# Altium schematic sheet 990130_Schematic.SchDoc
size A
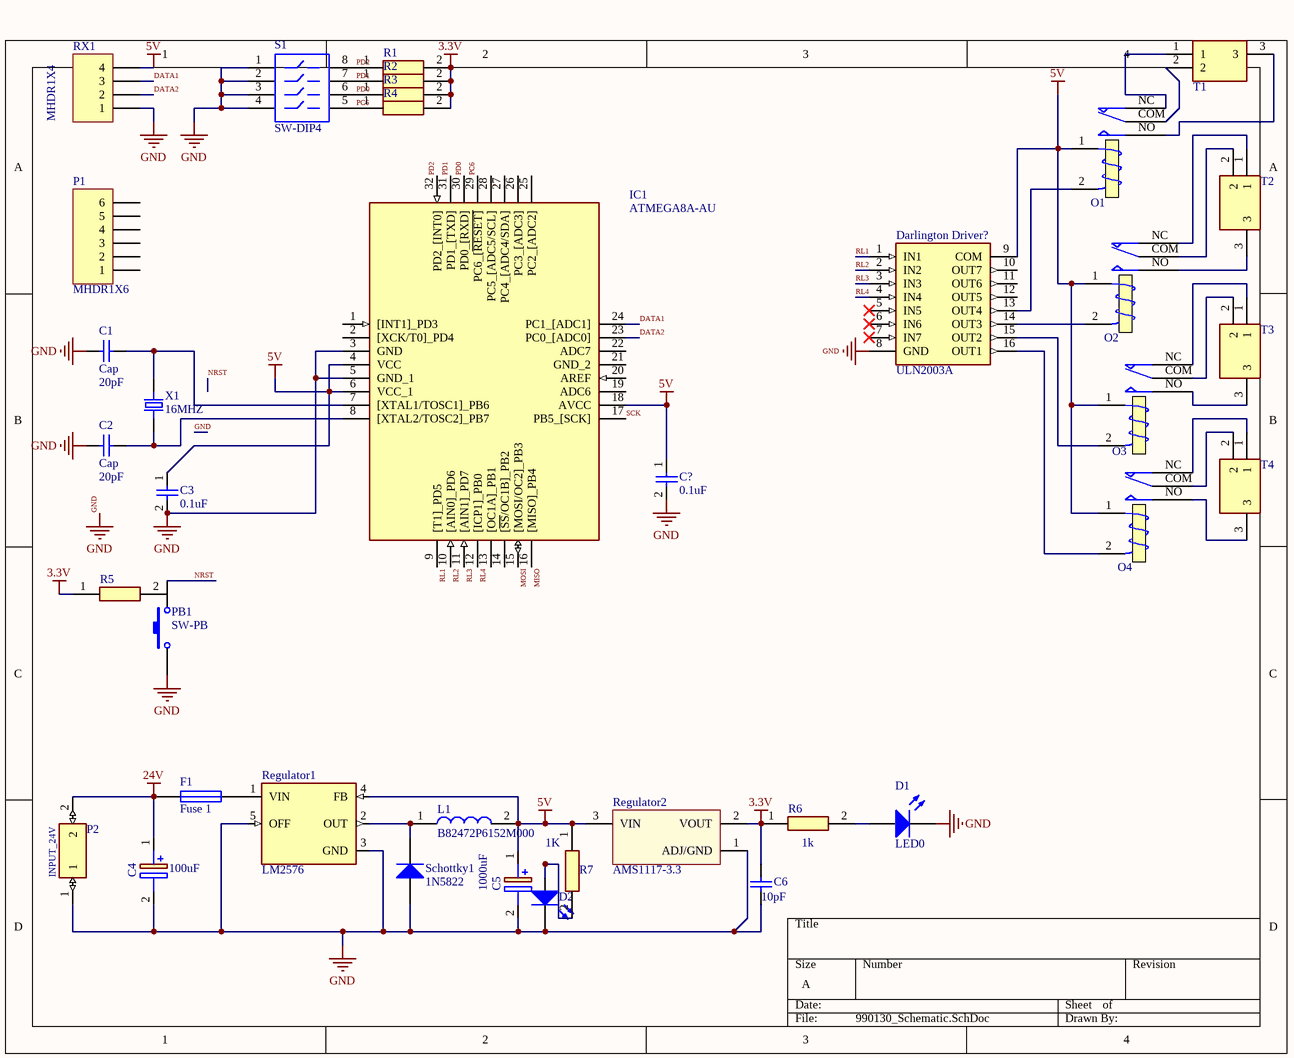
[diagram p0: 990130_Schematic.SchDoc]

## Parts
C1  Cap  value 20pF  [RAD-0.3]
C2  Cap  value 20pF  [RAD-0.3]
C3  0.1uF  [RAD-0.3]
C4  100uF  [CAPPRD550W60D1050H2150]
C5  1000uF  [CAPPRD550W60D1050H2150]
C6  value 10pF  [RAD-0.3]  (hidden comment: Cap)
C?  0.1uF  [RAD-0.3]
D1  LED0  [LED-0]
D2  LED0  [LED-0]  (value not drawn)
Darlington_Driver?  ULN2003A  [DIP794W56P254L1918H533Q16N]
F1  Fuse 1  [PIN-W2/E2.8]
IC1  ATMEGA8A-AU  [QFP80P900X900X120-32N]
L1  B82472P6152M000  [INDPM7474X450N]
O1  12V SMALL  [Relay_5_Small]  (value not drawn)
O2  12V SMALL  [Relay_5_Small]  (value not drawn)
O3  12V SMALL  [Relay_5_Small]  (value not drawn)
O4  12V SMALL  [Relay_5_Small]  (value not drawn)
P1  MHDR1X6  [MHDR1X6]
P2  INPUT_24V  [1725656]
PB1  SW-PB  [SPST-2]
R1  CRCW120610M0FKEA  [RESC3216X60N]  (value not drawn)
R2  CRCW120610M0FKEA  [RESC3216X60N]  (value not drawn)
R3  CRCW120610M0FKEA  [RESC3216X60N]  (value not drawn)
R4  CRCW120610M0FKEA  [RESC3216X60N]  (value not drawn)
R5  CRCW120610M0FKEA  [RESC3216X60N]  (value not drawn)
R6  1k  [RESC3216X60N]
R7  1K  [RESC3216X60N]
Regulator1  LM2576  [TO220-5]
Regulator2  AMS1117-3.3  [SOT229P700X180-4N]
RX1  MHDR1X4  [MHDR1X4]
S1  SW-DIP4  [DIP-8]
Schottky1  1N5822  [DO-41]
T1  1725669  [1725669]  (value not drawn)
T2  1725669  [1725669]  (value not drawn)
T3  1725669  [1725669]  (value not drawn)
T4  1725669  [1725669]  (value not drawn)
X1  16MHZ  [XTAL_ABLS-8.000MHZ-B2-T]

## Nets
3.3V: C6.1 R1.2 R2.2 R3.2 R4.2 R5.1 R6.1 Regulator2.2(VOUT)
5V: C3.1 C5.1(+) C?.1 Darlington_Driver?.9(COM) IC1.4(VCC) IC1.6(VCC_1) IC1.18(AVCC) L1.2 O1.1 O2.1 O3.1 O4.1 R7.1 Regulator1.4(FB) Regulator2.3(VIN) RX1.4
24V: C4.1(+) F1.1 P2.2
GND: C1.1 C2.1 C3.2 C4.2(-) C5.2(-) C6.2 C?.2 D1.2(K) D2.2(K) Darlington_Driver?.8(GND) IC1.3(GND) IC1.5(GND_1) P2.1 PB1.1 Regulator1.3(GND) Regulator1.5(OFF) Regulator2.1(ADJ/GND) RX1.1 S1.1 S1.2 S1.3 S1.4 Schottky1.1(A)
DATA1: IC1.24(PC1_[ADC1]) RX1.3
DATA2: IC1.23(PC0_[ADC0]) RX1.2
MISO: IC1.16([MISO]_PB4)
MOSI: IC1.15([MOSI/OC2]_PB3)
NRST: PB1.2
PC6: IC1.29(PC6_[~{RESET]}) R4.1 S1.5
PD0: IC1.30(PD0_[RXD]) R3.1 S1.6
PD1: IC1.31(PD1_[TXD]) R2.1 S1.7
PD2: IC1.32(PD2_[INT0]) R1.1 S1.8
RL1: Darlington_Driver?.1(IN1) IC1.9([T1]_PD5)
RL2: Darlington_Driver?.2(IN2) IC1.10([AIN0]_PD6)
RL3: Darlington_Driver?.3(IN3) IC1.11([AIN1]_PD7)
RL4: Darlington_Driver?.4(IN4) IC1.12([ICP1]_PB0)
SCK: IC1.17(PB5_[SCK])
NetC1_2: C1.2 IC1.7([XTAL1/TOSC1]_PB6) X1.2
NetC2_2: C2.2 IC1.8([XTAL2/TOSC2]_PB7) X1.1
NetD1_1: D1.1(A) R6.2
NetD2_1: D2.1(A) R7.2
NetDarlington_Driver?_13: Darlington_Driver?.13(OUT4) O1.2
NetDarlington_Driver?_14: Darlington_Driver?.14(OUT3) O2.2
NetDarlington_Driver?_15: Darlington_Driver?.15(OUT2) O3.2
NetDarlington_Driver?_16: Darlington_Driver?.16(OUT1) O4.2
NetF1_2: F1.2 Regulator1.1(VIN)
NetL1_1: L1.1 Regulator1.2(OUT) Schottky1.2(K)
NetO1_COM: O1.COM T1.2
NetO1_NC: O1.NC T1.1
NetO1_NO: O1.NO T1.3
NetO2_COM: O2.COM T2.2
NetO2_NC: O2.NC T2.1
NetO2_NO: O2.NO T2.3
NetO3_COM: O3.COM T3.2
NetO3_NC: O3.NC T3.1
NetO3_NO: O3.NO T3.3
NetO4_COM: O4.COM T4.2
NetO4_NC: O4.NC T4.1
NetO4_NO: O4.NO T4.3

Not connected (* = marked no-connect by the designer): Darlington_Driver? 5(IN5)* 6(IN6)* 7(IN7)* 10(OUT7) 11(OUT6) 12(OUT5); IC1 1([INT1]_PD3) 2([XCK/T0]_PD4) 13([OC1A]_PB1) 14([~{SS}/OC1B]_PB2) 19(ADC6) 20(AREF) 21(GND_2) 22(ADC7) 25(PC2_[ADC2]) 26(PC3_[ADC3]) 27(PC4_[ADC4/SDA]) 28(PC5_[ADC5/SCL]); P1 1 2 3 4 5 6; R5 2

## Library data of the parts
C1-C3 C6 C? = Cap: Capacitor; Published: 8-Jun-2000; LatestRevisionDate: 17-Jul-2002; LatestRevisionNote: Re-released for DXP Platform.; PackageReference: RAD-0.3; Publisher: Altium Limited; PackageDescription: Radial Cap, Thru-Hole; 2 Leads; 0.3 in Pin Spacing
C4 C5 = 108CKE025M: Capacitor Polarised; Manufacturer_Name: Cinch; Datasheet Link: https://componentsearchengine.com/Datasheets/2/108CKE025M.pdf; Height: 21.5mm; Manufacturer_Part_Number: 108CKE025M
D1 D2 = LED0: Typical INFRARED GaAs LED; Published: 8-Jun-2000; LatestRevisionDate: 08-Jul-2005; LatestRevisionNote: Mech Layer 1 removed.; PackageReference: LED-0; Publisher: Altium Limited; PackageDescription: LED; 2 Leads
Darlington_Driver? = ULN2003A: Integrated Circuit; Manufacturer_Name: STMicroelectronics; Allied_Number: 70014189; Datasheet Link: http://www.st.com/web/en/resource/technical/document/datasheet/CD00001244.pdf; Height: 5.33mm; Manufacturer_Part_Number: ULN2003A; Mouser Part Number: 511-ULN2003A; Mouser Price/Stock: https://www.mouser.com/Search/Refine.aspx?Keyword=511-ULN2003A; RS Part Number: 6868209; RS Price/Stock: http://uk.rs-online.com/web/p/products/6868209; Allied Price/Stock: http://www.alliedelec.com/stmicroelectronics-uln2003a/70014189/
F1 = Fuse 1: Fuse; Published: 8-Jun-2000; LatestRevisionDate: 17-Jul-2002; LatestRevisionNote: Re-released for DXP Platform.; PackageReference: PIN-W2/E2.8; Publisher: Altium Limited; PackageDescription: Thru-Hole; 2 Leads
IC1 = ATMEGA8A-AU: Integrated Circuit; Manufacturer_Name: Microchip; Datasheet Link: http://www.atmel.com/images/atmel-8159-8-bit-avr-microcontroller-atmega8a_datasheet.pdf; Height: 1.2mm; Manufacturer_Part_Number: ATMEGA8A-AU; Mouser Part Number: 556-ATMEGA8A-AU; Mouser Price/Stock: https://www.mouser.com/Search/Refine.aspx?Keyword=556-ATMEGA8A-AU; RS Part Number: 1310370P; RS Price/Stock: http://uk.rs-online.com/web/p/products/1310370P
L1 = B82472P6152M000: Inductor; Manufacturer_Name: EPCOS; Datasheet Link: https://www.tdk-electronics.tdk.com/inf/30/db/ind_2008/b82472p6.pdf; Height: 4.5mm; Manufacturer_Part_Number: B82472P6152M000; Mouser Part Number: 871-B82472P6152M000; Mouser Price/Stock: https://www.mouser.com/Search/Refine.aspx?Keyword=871-B82472P6152M000
O1-O3 = HJR-78F-12VDC-S-Z: Manufacturer: TIANBO; Rating: 7A, 120VAC; Link to Datasheet: *; Link to Picture: *; Operating Temp: -40°C to +85°C; Storage Temp: -40°C to +105°C; Tolerance: *; ComponentLink1Description: *; ComponentLink1URL: *; Manufacture Part #: HJR-78F-12VDC-S-Z; Value: 12V SMALL
O4 = HJR-78F-12VDC-S-Z: Manufacturer: TIANBO; Manufacturer Part Number: STM8S003K3T6C; Rating: 7A, 120VAC; Interface: I2C,SPI,IrDA,UART,USART,LIN; RAM Size: 1KB; Max Frequency: 16MHz; Number of Timers/Counters: 7; Data Bus Width: 8b; Number of Programmable I/O: 28; Watchdog Timer: Yes; Memory Type: FLASH; Memory Size: 8KB; Max Supply Voltage: 5.5V; Min Supply Voltage: 2.95V; Max Power Dissipation: 330mW; Oscillator Type: Internal; Peripherals: Brown-out Detect/Reset,POR,PWM,WDT,I2C; Number of ADC Channels: 5; Number of SPI Channels: 1; Data Rate: 8Mbps; Link to Datasheet: *; Link to Picture: *; Operating Temp: -40°C to +85°C; Storage Temp: -40°C to +105°C; Tolerance: *; ComponentLink1Description: *; ComponentLink1URL: *; Manufacture Part #: HJR-78F-12VDC-S-Z; Value: 12V SMALL; Supplier 1: Future Electronics; Stock 1: 0; Mount: Surface Mount; Case/Package: LQFP; Number of Pins: 32; Min Operating Temperature: -40°C; Max Operating Temperature: 85°C; Packaging: Tray; Number of I/Os: 28; Package Quantity: 250; Frequency: 16MHz; Number of I2C Channels: 1; Number of UART Channels: 1; Length: 7.2mm; Height: 1.45mm; Width: 7.2mm; Radiation Hardening: No; Lead Free: Lead Free; REACH SVHC: No SVHC; ComponentLink2URL: http://www.st.com/web/en/resource/technical/document/datasheet/DM00024550.pdf?src-supplier=Future+Electronics; ComponentLink2Description: http://www.st.com/web/en/resource/technical/document/datasheet/DM00024550.pdf?src-supplier=Future+Electronics; ComponentLink3URL: http://www.st.com/web/en/resource/technical/document/datasheet/DM00024550.pdf?src-supplier=Avnet+Europe; ComponentLink3Description: http://www.st.com/web/en/resource/technical/document/datasheet/DM00024550.pdf?src-supplier=Avnet+Europe; ComponentLink4URL: http://www.st.com/web/en/resource/technical/document/datasheet/DM00024550.pdf?src-supplier=Mouser; ComponentLink4Description: http://www.st.com/web/en/resource/technical/document/datasheet/DM00024550.pdf?src-supplier=Mouser
P1 = MHDR1X6: Header, 6-Pin; LatestRevisionDate: 17-Jul-2002; LatestRevisionNote: Re-released for DXP Platform.; Publisher: Altium Limited
P2 = 1725656: Connector; Manufacturer_Name: Phoenix Contact; Allied_Number: 70054335; Datasheet Link: https://www.phoenixcontact.com/online/portal/gb?uri=pxc-oc-itemdetail:pid=1725656&library=gben&tab=1; Height: 8mm; Manufacturer_Part_Number: 1725656; Mouser Part Number: 651-1725656; Mouser Price/Stock: https://www.mouser.com/Search/Refine.aspx?Keyword=651-1725656; RS Part Number: 3909023; RS Price/Stock: https://uk.rs-online.com/web/p/products/3909023; Allied Price/Stock: http://www.alliedelec.com/phoenix-contact-1725656/70054335/
PB1 = SW-PB: Switch; Published: 24-Mar-1999; LatestRevisionDate: 17-Jul-2002; LatestRevisionNote: Re-released for DXP Platform.; PackageReference: SPST-2; Publisher: Altium Limited; PackageDescription: Switch; 2 Leads
R1-R7 = CRCW120610M0FKEA: Resistor; Manufacturer_Name: Vishay; Allied_Number: 70204450; Height: 0.6mm; Manufacturer_Part_Number: CRCW120610M0FKEA; Mouser Part Number: 71-CRCW1206-10M-E3; Mouser Price/Stock: https://www.mouser.com/Search/Refine.aspx?Keyword=71-CRCW1206-10M-E3; Allied Price/Stock: https://www.alliedelec.com/vishay-dale-crcw120610m0fkea/70204450/
Regulator1 = LM2576: Buck Switching Regulator IC Positive Fixed 5V 1 Output 3A TO-263-6, DÂ²Pak _5 Leads + Tab_, TO-263BA; MF: Texas Instruments; Price: None; Package: TO-263-6 National Semiconductor; Value: *; MP: LM2576; Availability: Unavailable; SnapEDA_Link: https://www.snapeda.com/parts/LM2576/Texas%20Instruments/view-part/214937/?ref=snap
Regulator2 = AMS1117: Low-dropout regulator; Type: AMS1117-3.3
RX1 = MHDR1X4: Header, 4-Pin; LatestRevisionDate: 17-Jul-2002; LatestRevisionNote: Re-released for DXP Platform.; Publisher: Altium Limited
S1 = SW-DIP4: DIP Switch; Published: 24-Mar-1999; LatestRevisionDate: 17-Jul-2002; LatestRevisionNote: Re-released for DXP Platform.; PackageReference: DIP-8; Publisher: Altium Limited
Schottky1 = Diode 1N4001: 1 Amp General Purpose Rectifier; Published: 8-Jun-2000; LatestRevisionDate: 17-Jul-2002; LatestRevisionNote: Re-released for DXP Platform.; DatasheetVersion: 1998; PackageVersion: Aug-1999; PackageReference: DO-41; Publisher: Altium Limited; PackageDescription: Diode, Axial; Body 5.2 x 2.7 mm (LxDia. max), Lead Dia. 0.86 mm (max); Code_JEDEC: DO-204-AL; ComponentLink1Description: Manufacturer Link; ComponentLink1URL: http://www.fairchildsemi.com/; ComponentLink2Description: Datasheet; ComponentLink2URL: http://www.fairchildsemi.com/ds/1N%2F1N4001.pdf
T1-T4 = 1725669: Connector; Manufacturer_Name: Phoenix Contact; Allied_Number: 70054336; Datasheet Link: https://www.phoenixcontact.com/online/portal/gb?uri=pxc-oc-itemdetail:pid=1725669&library=gben&tab=1; Height: 8.5mm; Manufacturer_Part_Number: 1725669; Mouser Part Number: 651-1725669; Mouser Price/Stock: https://www.mouser.com/Search/Refine.aspx?Keyword=651-1725669; RS Part Number: 3909039; RS Price/Stock: https://uk.rs-online.com/web/p/products/3909039; Allied Price/Stock: http://www.alliedelec.com/phoenix-contact-1725669/70054336/
X1 = ABLS-8.000MHZ-B2-T: 8MHz Â±20ppm Crystal 18pF 80 Ohms HC-49/US; MF: Abracon LLC; Value: *; MP: ABLS-8.000MHZ-B2; Package: HC-49/US Abracon LLC; SnapEDA_Link: https://www.snapeda.com/parts/ABLS-8.000MHZ-B2/Abracon%20LLC/view-part/2753215/?ref=snap; Price: None; Availability: Unavailable